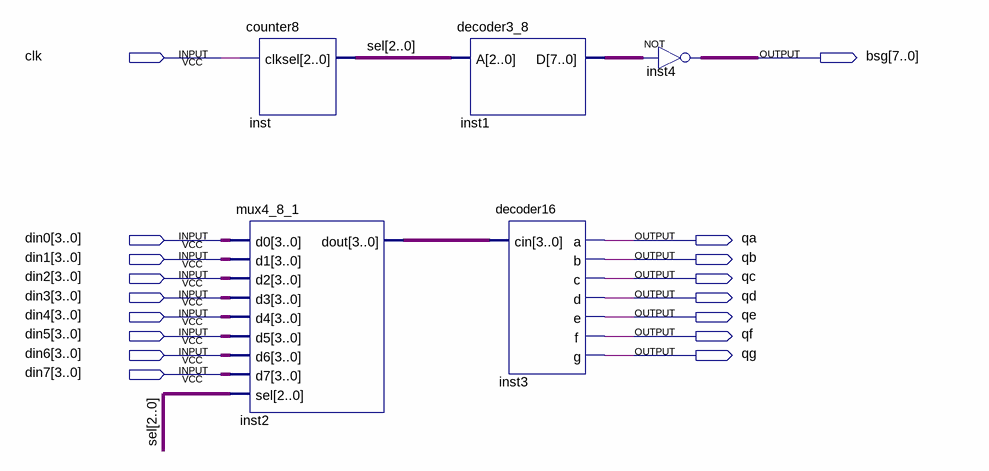
[diagram p0: schematic sheet]
// Quartus schematic xianshi.bdf as structural Verilog: 5 symbols, 17 pins
module xianshi (
  input  clk,
  input  [3:0] din0,
  input  [3:0] din1,
  input  [3:0] din2,
  input  [3:0] din3,
  input  [3:0] din4,
  input  [3:0] din5,
  input  [3:0] din6,
  input  [3:0] din7,
  output [7:0] bsg,
  output qa,
  output qb,
  output qc,
  output qd,
  output qe,
  output qf,
  output qg
);

  wire [2:0] sel;
  wire [3:0] inst2_dout;
  wire [7:0] inst1_d;

  counter8 inst (.clk(clk), .sel(sel));
  mux4_8_1 inst2 (
    .d0(din0), .d1(din1), .d2(din2), .d3(din3), .d4(din4), .d5(din5), .d6(din6), .d7(din7), .sel(sel),
    .dout(inst2_dout));
  decoder3_8 inst1 (.A(sel), .D(inst1_d));
  decoder16 inst3 (.cin(inst2_dout), .a(qa), .b(qb), .c(qc), .d(qd), .e(qe), .f(qf), .g(qg));
  assign bsg = ~inst1_d;  // NOT inst4, 8 bits wide
endmodule
